# EAGLE design lcd (EAGLE 7.2.0)
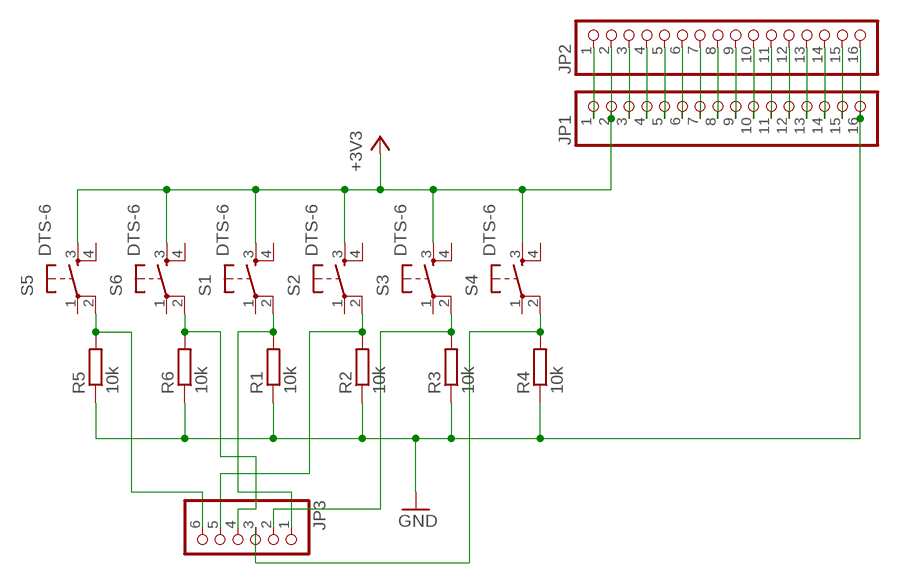
[diagram p0: schematic, sheet 1]

## Parts
JP1  PINHD-1X16  [1X16]
JP2  PINHD-1X16  [1X16]
JP3  PINHD-1X6  [1X06]
R1  10k  R-EU_R0805  [R0805]
R2  10k  R-EU_R0805  [R0805]
R3  10k  R-EU_R0805  [R0805]
R4  10k  R-EU_R0805  [R0805]
R5  10k  R-EU_R0805  [R0805]
R6  10k  R-EU_R0805  [R0805]
S1  DTS-6  [DTS-6]
S2  DTS-6  [DTS-6]
S3  DTS-6  [DTS-6]
S4  DTS-6  [DTS-6]
S5  DTS-6  [DTS-6]
S6  DTS-6  [DTS-6]

## Nets
+3V3: JP1.2 JP2.2 S1.3 S2.3 S3.3 S4.3 S5.3 S6.3
GND: JP1.16 JP2.16 R1.1 R2.1 R3.1 R4.1 R5.1 R6.1
N$1: JP3.1 R1.2 S1.2
N$2: JP3.5 R2.2 S2.2
N$3: JP3.2 R3.2 S3.2
N$4: JP1.1 JP2.1
N$5: JP3.3 R4.2 S4.2
N$7: JP3.6 R5.2 S5.2
N$8: JP3.4 R6.2 S6.2
N$10: JP1.3 JP2.3
N$11: JP1.4 JP2.4
N$12: JP1.5 JP2.5
N$13: JP1.6 JP2.6
N$14: JP1.7 JP2.7
N$15: JP1.8 JP2.8
N$16: JP1.9 JP2.9
N$17: JP1.10 JP2.10
N$18: JP1.11 JP2.11
N$19: JP1.12 JP2.12
N$20: JP1.13 JP2.13
N$21: JP1.14 JP2.14
N$22: JP1.15 JP2.15
Unconnected: S1.1 S1.4 S2.1 S2.4 S3.1 S3.4 S4.1 S4.4 S5.1 S5.4 S6.1 S6.4

## Library data of the parts
JP1 JP2 = pinhead:PINHD-1X16: PIN HEADER
JP3 = pinhead:PINHD-1X6: PIN HEADER
R1-R6 = rcl:R-EU_: RESISTOR, European symbol
S1-S6 = switch-tact:DTS-6

## Board
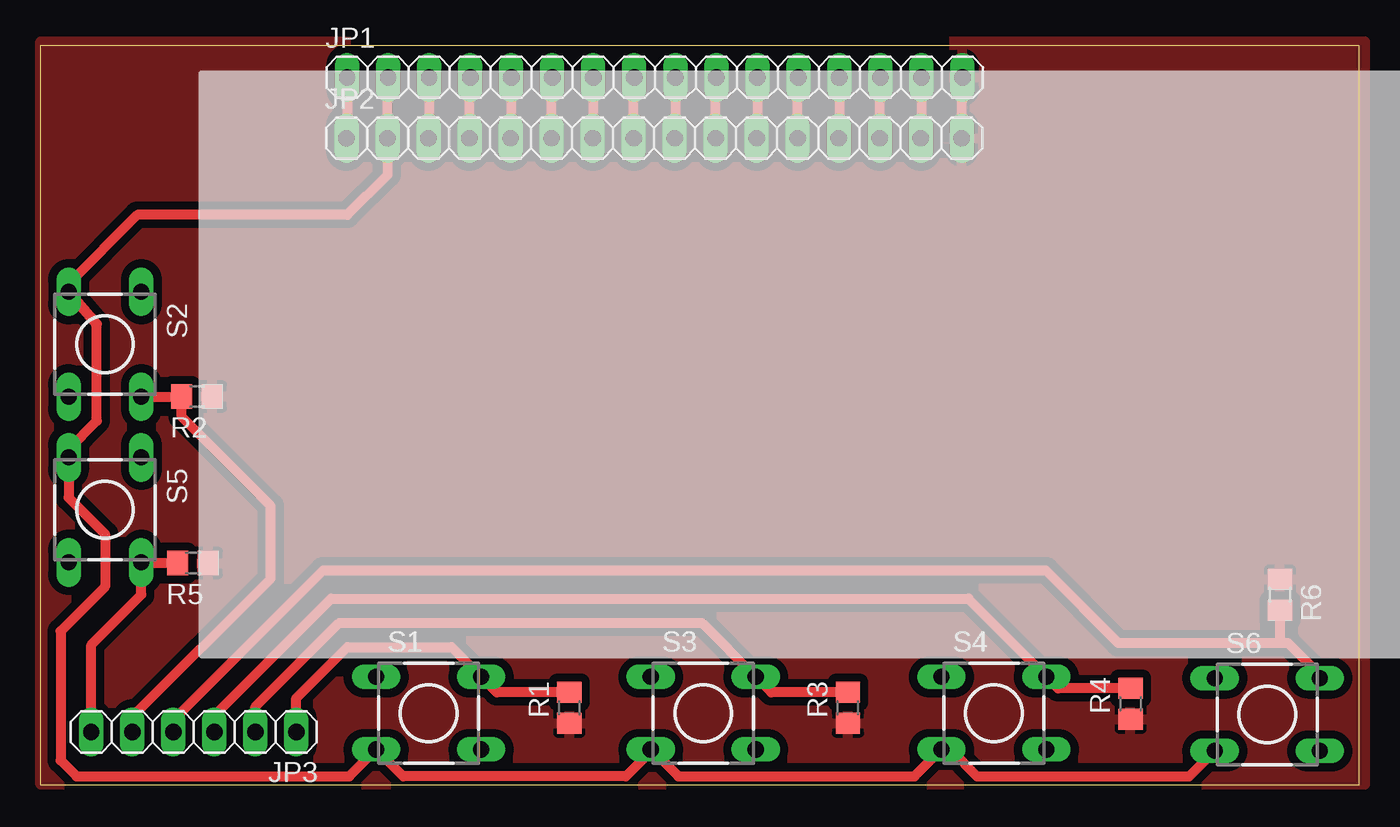
[diagram p1: board, top side]

Size 81.65 x 45.71 mm. Coordinates in mm from the lower left corner, seen from the top.
Outline: 0,0 81.65,0 81.65,45.71 0,45.71 0,0
Copper layers (1*16): Top 0.035mm / dielectric 1.5mm / Bottom 0.035mm
Design rules "diy": minimum track width 10mil, minimum drill 24mil, track to track 20mil, track to pad 20mil, pad to pad 20mil, via to via 8mil, smd to smd 0mil, copper to edge 0mil, drill to drill 8mil, minimum pad ring 10mil, minimum via ring 8mil, stop-mask expansion 4mil, vias tented up to drill 0mil, thermal gap 10mil
tRestrict: area 3.2,1 to 15.5,2.8; area 19.2,39.8 to 56.2,46.2

### Footprints (pad centres in the part's own frame; a part is rotated, then mirrored left to right if it is on the bottom)
1X16 = drill 1.016 long: 1 -19.05,0; 2 -16.51,0; 3 -13.97,0; 4 -11.43,0; 5 -8.89,0; 6 -6.35,0; 7 -3.81,0; 8 -1.27,0; 9 1.27,0; 10 3.81,0; 11 6.35,0; 12 8.89,0; 13 11.43,0; 14 13.97,0; 15 16.51,0; 16 19.05,0
1X06 = drill 1.016 long: 1 -6.35,0; 2 -3.81,0; 3 -1.27,0; 4 1.27,0; 5 3.81,0; 6 6.35,0
R0805 = smd 1.3 x 1.5: 1 -0.95,0; 2 0.95,0
DTS-6 = drill 1 long: 1 -3.25,2.25; 2 3.25,2.25; 3 -3.25,-2.25; 4 3.25,-2.25

### Placement (x,y rotation side)
JP1  38.04,43.77 0 top
JP2  38,40 0 top
JP3  9.5,3.25 180 top
R1  32.75,4.75 90 top
R2  9.69,24.02 180 top
R3  50,4.75 90 top
R4  67.5,5 90 top
R5  9.44,13.71 180 top
R6  76.75,11.75 270 top
S1  24.04,4.42 0 top
S2  4,27.25 270 top
S3  41.04,4.42 0 top
S4  59.04,4.42 0 top
S5  4,17 270 top
S6  75.96,4.33 0 top

### Tracks (layer width: path | path; a pad name or v marks a point on that pad's centre or on a via)
+3V3
  Top 0.61: JP1.2 21.49,43.73 JP2.2 21.49,37.74 19,35.25 6,35.25 1.75,31 S2.3 3.5,28.5 3.5,22.5 1.75,20.75 S5.3 1.75,17.75 4,15.5 4,12.25 1.25,9.5 1.25,1.5 2.25,0.5 19.12,0.5 S1.3 22.46,0.5 36.25,0.5 37.79,2.04 S3.3 37.83,2.17 39.5,0.5 54.12,0.5 S4.3 56.33,2.17 58,0.5 71.13,0.5 S6.3
GND
  Top 0.61: JP2.16 57.05,43.73 JP1.16
  pour Top: 0,46 82,46 82,0 0,0
N$1
  Top 0.61: JP3.1 15.85,5.35 19,8.5 25.46,8.5 S1.2 28.26,5.7 R1.2
N$2
  Top 0.61: S2.2 8.72,24 R2.2 8.75,22.75 14.25,17.25 14.25,12.75 5.69,4.19 JP3.5
N$3
  Top 0.61: JP3.2 13.31,4.81 18.5,10 40.96,10 S3.2 45.26,5.7 R3.2
N$4
  Top 0.61: JP1.1 18.99,40.04 JP2.1
N$5
  Top 0.61: JP3.3 10.77,4.27 18,11.5 57.46,11.5 S4.2 63.01,5.95 R4.2
N$7
  Top 0.61: JP3.6 3.15,8.65 6.25,11.75 S5.2 6.71,13.71 R5.2
N$8
  Top 0.61: JP3.4 8.23,3.98 17.5,13.25 62.25,13.25 66.75,8.75 76.75,8.75 | S6.2 79.21,6.79 77.25,8.75 76.75,8.75 | R6.2 76.75,8.75
N$10
  Top 0.61: JP1.3 24.07,40.04 JP2.3
N$11
  Top 0.61: JP2.4 26.57,43.18 26.5,43.25 26.5,43.66 JP1.4
N$12
  Top 0.61: JP1.5 29.15,40.04 JP2.5
N$13
  Top 0.61: JP2.6 31.65,43.73 JP1.6
N$14
  Top 0.61: JP1.7 34.23,40.04 JP2.7
N$15
  Top 0.61: JP2.8 36.73,43.73 JP1.8
N$16
  Top 0.61: JP1.9 39.31,39.56 39.25,39.5 39.25,39.98 JP2.9
N$17
  Top 0.61: JP2.10 41.81,43.73 JP1.10
N$18
  Top 0.61: JP1.11 44.39,40.04 JP2.11
N$19
  Top 0.61: JP2.12 46.89,43.73 JP1.12
N$20
  Top 0.61: JP1.13 49.47,40.04 JP2.13
N$21
  Top 0.61: JP2.14 51.97,43.73 JP1.14
N$22
  Top 0.61: JP1.15 54.55,40.04 JP2.15